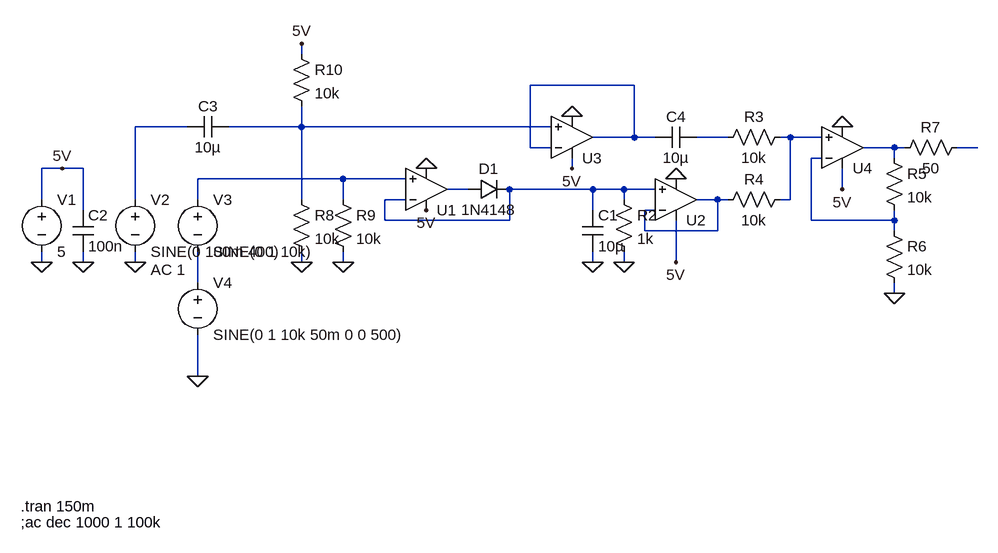
[diagram p0: schematic pc-gen.asc]
pc-gen.asc, the LTspice schematic file:
Version 4
SHEET 1 1060 720
WIRE 16 -16 16 -32
WIRE 528 32 368 32
WIRE -160 96 -240 96
WIRE 16 96 16 64
WIRE 16 96 -96 96
WIRE 400 96 16 96
WIRE 528 112 528 32
WIRE 528 112 464 112
WIRE 560 112 528 112
WIRE 672 112 624 112
WIRE 768 112 752 112
WIRE 816 112 768 112
WIRE 368 128 368 32
WIRE 400 128 368 128
WIRE 928 128 880 128
WIRE 944 128 928 128
WIRE 1056 128 1024 128
WIRE 816 144 800 144
WIRE 928 144 928 128
WIRE -352 160 -384 160
WIRE -320 160 -352 160
WIRE 432 160 432 144
WIRE 80 176 -144 176
WIRE 176 176 80 176
WIRE 272 192 240 192
WIRE 464 192 336 192
WIRE 512 192 464 192
WIRE 560 192 512 192
WIRE 848 192 848 160
WIRE -384 208 -384 160
WIRE -240 208 -240 96
WIRE -144 208 -144 176
WIRE 16 208 16 96
WIRE 80 208 80 176
WIRE 176 208 144 208
WIRE 512 208 512 192
WIRE 656 208 624 208
WIRE 672 208 656 208
WIRE 768 208 768 112
WIRE 768 208 752 208
WIRE -320 224 -320 160
WIRE 464 224 464 192
WIRE 560 224 544 224
WIRE 144 240 144 208
WIRE 336 240 336 192
WIRE 336 240 144 240
WIRE 800 240 800 144
WIRE 928 240 928 224
WIRE 928 240 800 240
WIRE 544 256 544 224
WIRE 656 256 656 208
WIRE 656 256 544 256
WIRE 928 256 928 240
WIRE -384 304 -384 288
WIRE -320 304 -320 288
WIRE -240 304 -240 288
WIRE 16 304 16 288
WIRE 80 304 80 288
WIRE 464 304 464 288
WIRE 512 304 512 288
WIRE 592 304 592 240
WIRE -144 336 -144 288
WIRE 928 352 928 336
WIRE -144 480 -144 416
FLAG -384 304 0
FLAG -240 304 0
FLAG -144 480 0
FLAG 464 304 0
FLAG 512 304 0
FLAG 928 352 0
FLAG -320 304 0
FLAG 16 304 0
FLAG 80 304 0
FLAG 208 160 0
FLAG 592 176 0
FLAG 848 96 0
FLAG 432 80 0
FLAG -352 160 5V
FLAG 16 -32 5V
FLAG 208 224 5V
FLAG 432 160 5V
FLAG 592 304 5V
FLAG 848 192 5V
SYMBOL voltage -384 192 R0
WINDOW 123 0 0 Left 2
WINDOW 39 0 0 Left 2
SYMATTR InstName V1
SYMATTR Value 5
SYMBOL voltage -240 192 R0
WINDOW 123 24 124 Left 2
WINDOW 39 0 0 Left 2
SYMATTR Value2 AC 1
SYMATTR InstName V2
SYMATTR Value SINE(0 100m 400)
SYMBOL voltage -144 192 R0
WINDOW 123 0 0 Left 2
WINDOW 39 0 0 Left 2
SYMATTR InstName V3
SYMATTR Value SINE(0 1 10k)
SYMBOL diode 272 208 R270
WINDOW 0 32 32 VTop 2
WINDOW 3 0 32 VBottom 2
SYMATTR InstName D1
SYMATTR Value 1N4148
SYMBOL cap 448 224 R0
SYMATTR InstName C1
SYMATTR Value 10µ
SYMBOL res 496 192 R0
SYMATTR InstName R2
SYMATTR Value 1k
SYMBOL res 656 128 R270
WINDOW 0 32 56 VTop 2
WINDOW 3 0 56 VBottom 2
SYMATTR InstName R3
SYMATTR Value 10k
SYMBOL res 656 224 R270
WINDOW 0 32 56 VTop 2
WINDOW 3 0 56 VBottom 2
SYMATTR InstName R4
SYMATTR Value 10k
SYMBOL res 912 128 R0
SYMATTR InstName R5
SYMATTR Value 10k
SYMBOL res 912 240 R0
SYMATTR InstName R6
SYMATTR Value 10k
SYMBOL res 928 144 R270
WINDOW 0 32 56 VTop 2
WINDOW 3 0 56 VBottom 2
SYMATTR InstName R7
SYMATTR Value 50
SYMBOL cap -336 224 R0
SYMATTR InstName C2
SYMATTR Value 100n
SYMBOL res 0 192 R0
SYMATTR InstName R8
SYMATTR Value 10k
SYMBOL res 64 192 R0
SYMATTR InstName R9
SYMATTR Value 10k
SYMBOL res 0 -32 R0
SYMATTR InstName R10
SYMATTR Value 10k
SYMBOL cap -160 112 R270
WINDOW 0 32 32 VTop 2
WINDOW 3 0 32 VBottom 2
SYMATTR InstName C3
SYMATTR Value 10µ
SYMBOL cap 560 128 R270
WINDOW 0 32 32 VTop 2
WINDOW 3 0 32 VBottom 2
SYMATTR InstName C4
SYMATTR Value 10µ
SYMBOL Opamps\\UniversalOpamp2 208 192 M180
SYMATTR InstName U1
SYMBOL Opamps\\UniversalOpamp2 592 208 M180
SYMATTR InstName U2
SYMBOL Opamps\\UniversalOpamp2 432 112 M180
SYMATTR InstName U3
SYMBOL Opamps\\UniversalOpamp2 848 128 M180
SYMATTR InstName U4
SYMBOL voltage -144 320 R0
WINDOW 123 0 0 Left 2
WINDOW 39 0 0 Left 2
SYMATTR InstName V4
SYMATTR Value SINE(0 1 10k 50m 0 0 500)
TEXT -416 680 Left 2 !.tran 150m
TEXT -416 704 Left 2 !;ac dec 1000 1 100k

The netlist it stands for:
* pc-gen.asc
V1 5V 0 5
V2 N002 0 SINE(0 100m 400) AC 1
V3 N009 N013 SINE(0 1 10k)
D1 N010 N011 1N4148
C1 N011 0 10µ
R2 N011 0 1k
R3 N004 N005 10k
R4 N012 N005 10k
R5 N006 N008 10k
R6 N008 0 10k
R7 N006 N007 50
C2 5V 0 100n
R8 N003 0 10k
R9 N009 0 10k
R10 5V N003 10k
C3 N002 N003 10µ
C4 N001 N004 10µ
XU1 N009 N011 5V 0 N010 level.2 Avol=1Meg GBW=10Meg Slew=10Meg ilimit=25m rail=0 Vos=0 phimargin=45 en=0 enk=0 in=0 ink=0 Rin=500Meg  ; pins IN+ IN- V+ V- OUT
XU2 N011 N012 5V 0 N012 level.2 Avol=1Meg GBW=10Meg Slew=10Meg ilimit=25m rail=0 Vos=0 phimargin=45 en=0 enk=0 in=0 ink=0 Rin=500Meg  ; pins IN+ IN- V+ V- OUT
XU3 N003 N001 5V 0 N001 level.2 Avol=1Meg GBW=10Meg Slew=10Meg ilimit=25m rail=0 Vos=0 phimargin=45 en=0 enk=0 in=0 ink=0 Rin=500Meg  ; pins IN+ IN- V+ V- OUT
XU4 N005 N008 5V 0 N006 level.2 Avol=1Meg GBW=10Meg Slew=10Meg ilimit=25m rail=0 Vos=0 phimargin=45 en=0 enk=0 in=0 ink=0 Rin=500Meg  ; pins IN+ IN- V+ V- OUT
V4 N013 0 SINE(0 1 10k 50m 0 0 500)
.model D D
.lib standard.dio
.tran 150m
;ac dec 1000 1 100k
.lib UniversalOpamps2.sub
.backanno
.end